# Altium schematic sheet QCopterMV_KEY_Sch.SchDoc: QCopterMV-KEY
size 127 x 101 mm; Author: Hom; CompanyName: KitSprout; DrawnBy: Hom; Engineer: Hom; Organization: KitSprout; Revision: A; SheetNumber: 1; SheetTotal: 1; Version: 2.0; LibVersion: 2.7
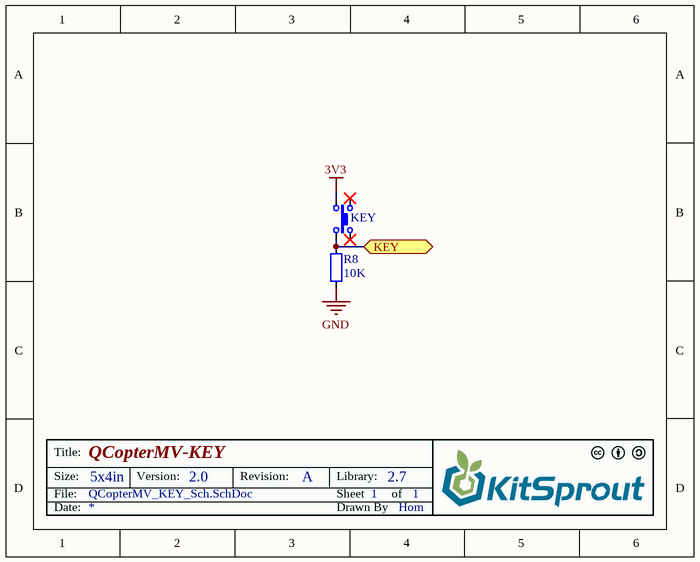
[diagram p0: QCopterMV_KEY_Sch.SchDoc]

## Parts
KEY  ButtonTACT  [ButtonTACT_3.5*3.55_90]  (value not drawn)
R8  value 10K  [RES_0603]  (hidden comment: Res_0603)

## Ports
KEY

## Nets
3V3: KEY.3
GND: R8.1
KEY: KEY.4 R8.2 ; port KEY

Not connected (* = marked no-connect by the designer): KEY 1* 2*

## Notes on the sheet
- Title:
- Size:
- Date:
- File:
- 5x4in
- Version:
- Revision:
- Sheet
- Drawn By
- Library:
- of

## Library data of the parts
KEY = ButtonTACT: Button
R8 = Res_0603: Resistor